# Altium schematic sheet 原理图(Altium).SchDoc
size A4
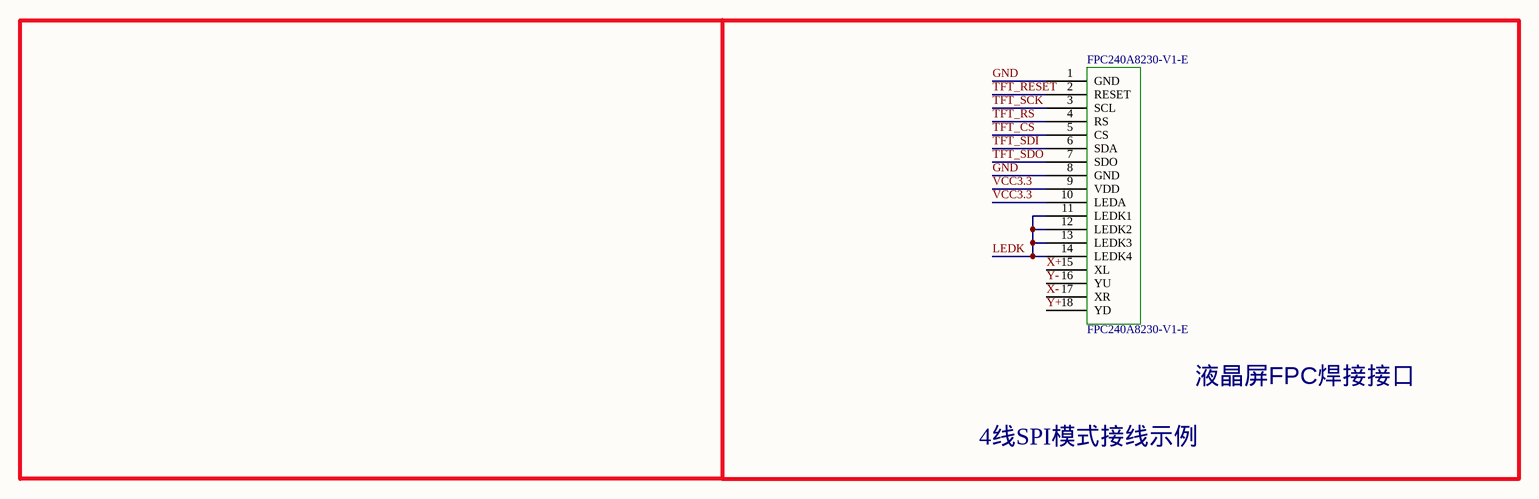
[diagram p0: 原理图(Altium).SchDoc]

## Parts
FPC240A8230-V1-E  FPC240A8230-V1-E  [FPC240A8230-V1-E]

## Nets
GND: FPC240A8230-V1-E.1(GND) FPC240A8230-V1-E.8(GND)
LEDK: FPC240A8230-V1-E.11(LEDK1) FPC240A8230-V1-E.12(LEDK2) FPC240A8230-V1-E.13(LEDK3) FPC240A8230-V1-E.14(LEDK4)
TFT_CS: FPC240A8230-V1-E.5(CS)
TFT_RESET: FPC240A8230-V1-E.2(RESET)
TFT_RS: FPC240A8230-V1-E.4(RS)
TFT_SCK: FPC240A8230-V1-E.3(SCL)
TFT_SDI: FPC240A8230-V1-E.6(SDA)
TFT_SDO: FPC240A8230-V1-E.7(SDO)
VCC3.3: FPC240A8230-V1-E.9(VDD) FPC240A8230-V1-E.10(LEDA)
X+: FPC240A8230-V1-E.15(XL)
X-: FPC240A8230-V1-E.17(XR)
Y+: FPC240A8230-V1-E.18(YD)
Y-: FPC240A8230-V1-E.16(YU)

## Notes on the sheet
- 液晶屏FPC焊接接口
- 4线SPI模式接线示例